# EAGLE schematic HHKB (EAGLE 9.2.0)
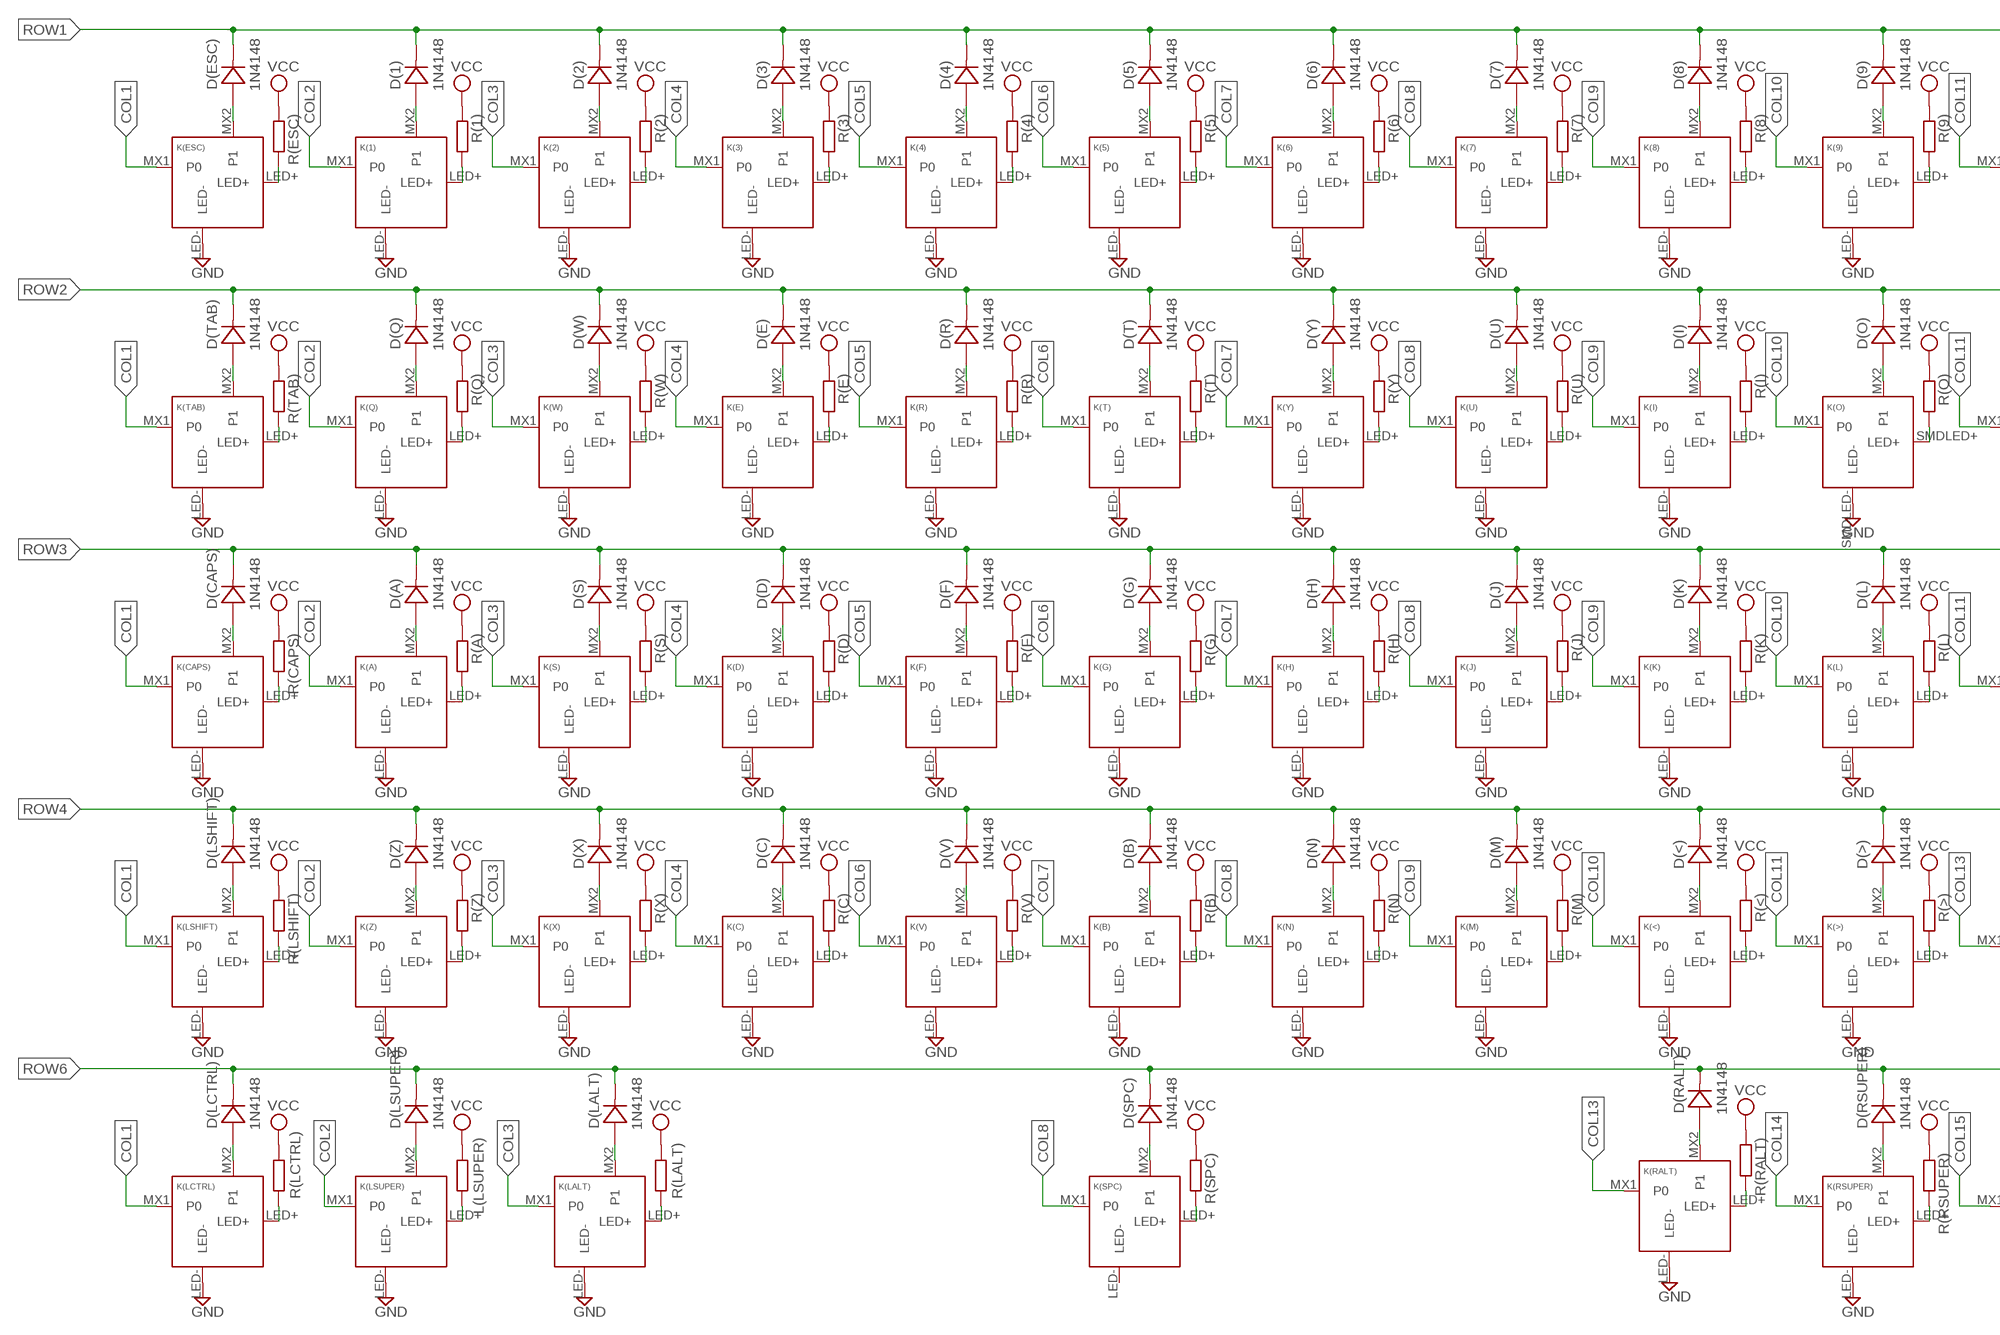
[diagram p0: schematic, sheet 1, part 1 of 2]
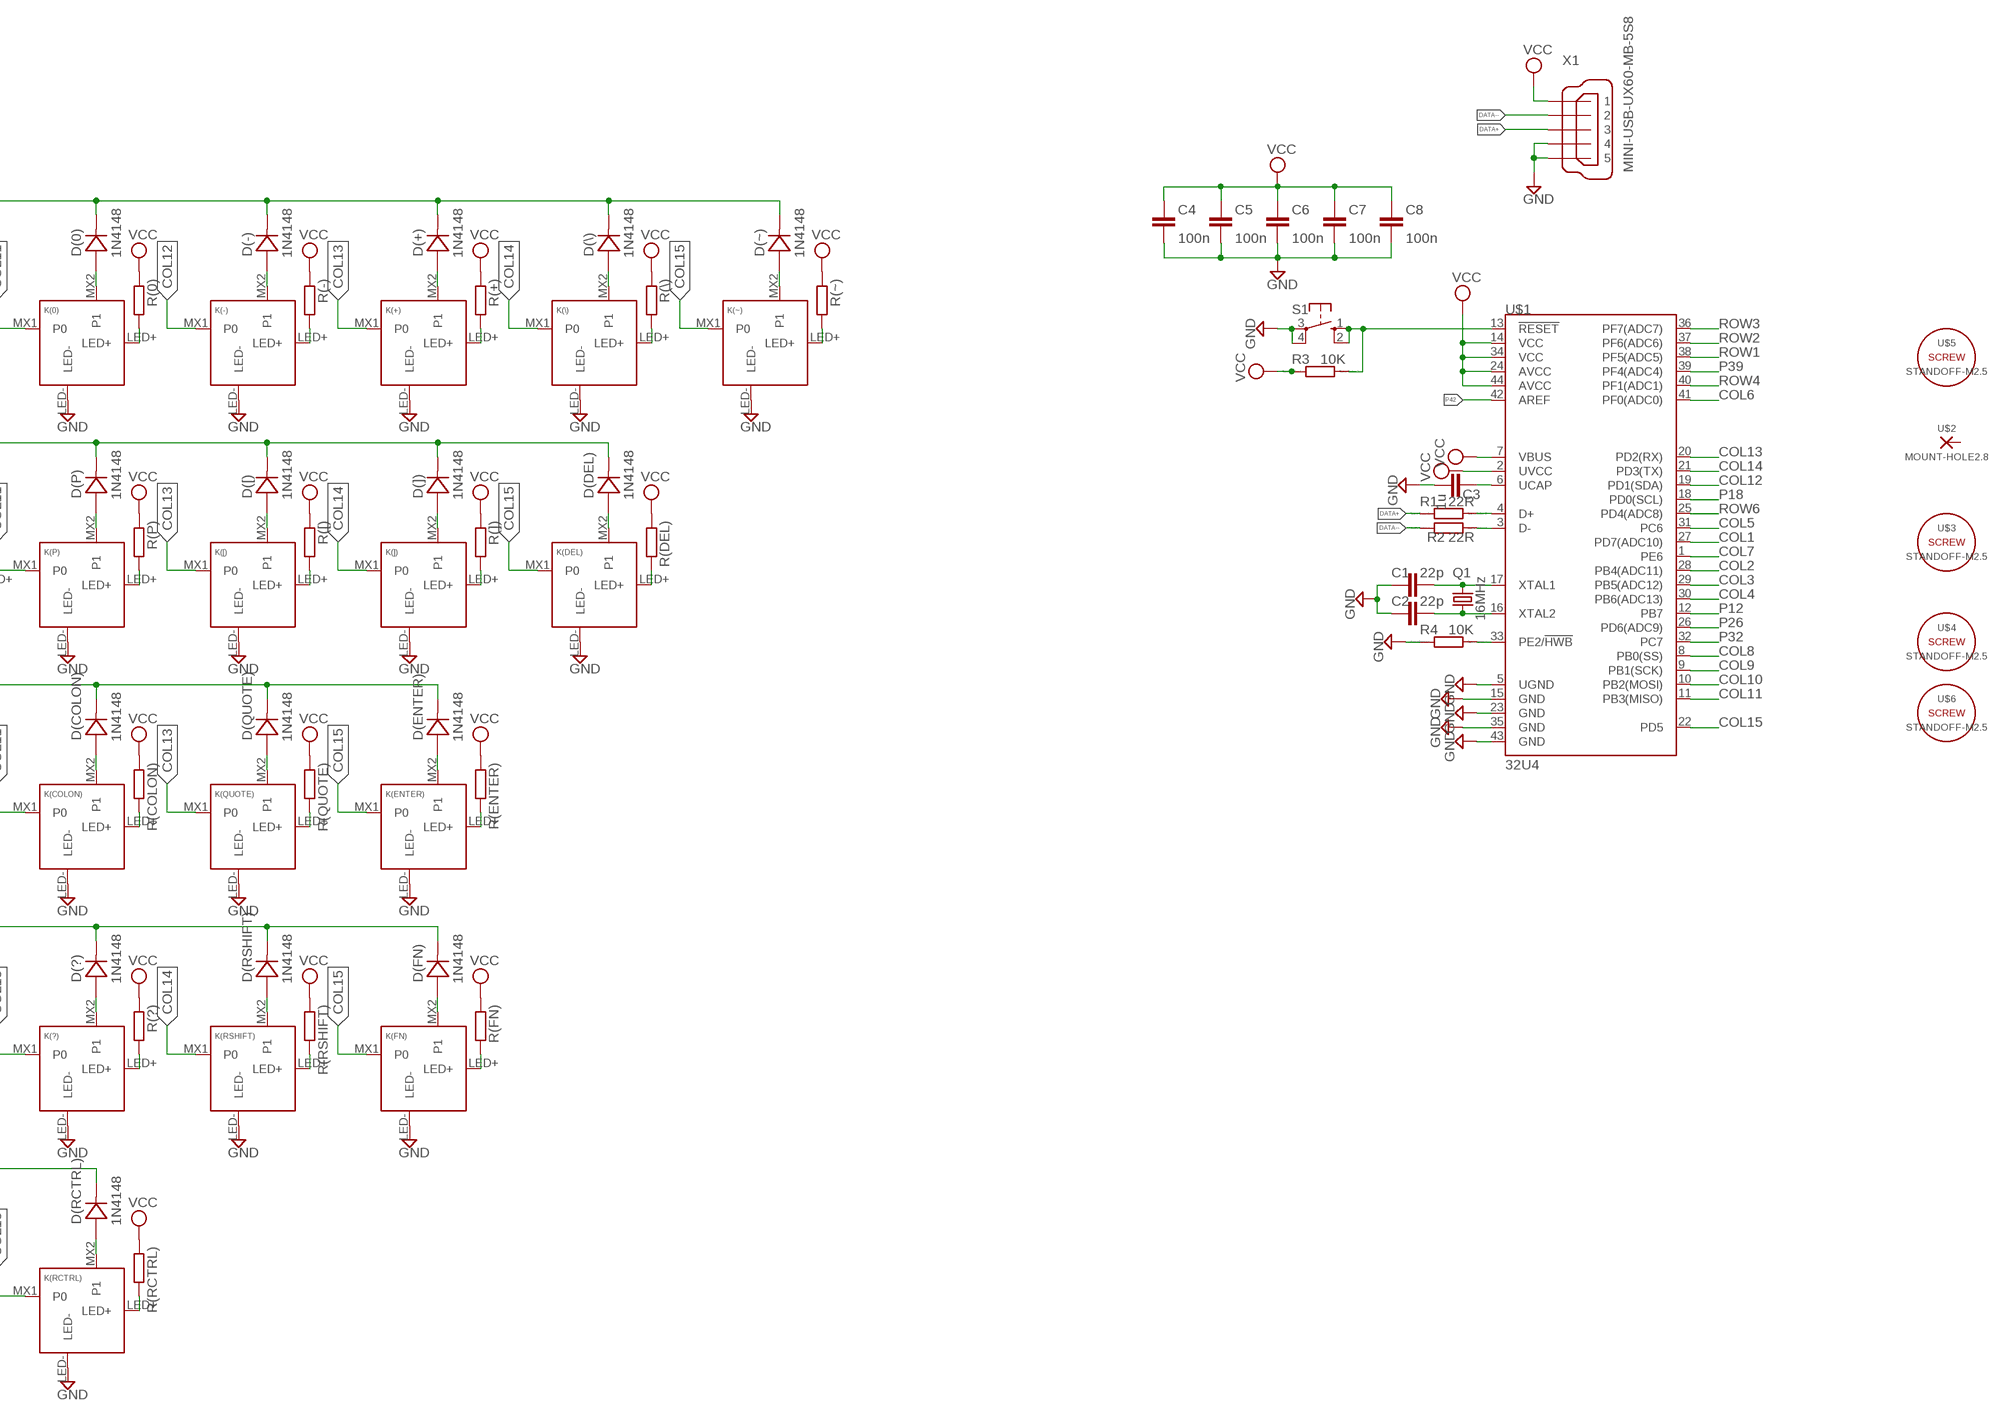
[diagram p1: schematic, sheet 1, part 2 of 2]

## Parts
C1  22p  C-EUC0805K  [C0805K]
C2  22p  C-EUC0805K  [C0805K]
C3  1u  C-EUC0805K  [C0805K]
C4  100n  C-EUC0805K  [C0805K]
C5  100n  C-EUC0805K  [C0805K]
C6  100n  C-EUC0805K  [C0805K]
C7  100n  C-EUC0805K  [C0805K]
C8  100n  C-EUC0805K  [C0805K]
D(0)  1N4148  DIODE-HAND  [DIODE_HAND]
D(1)  1N4148  DIODE-HAND  [DIODE_HAND]
D(2)  1N4148  DIODE-HAND  [DIODE_HAND]
D(3)  1N4148  DIODE-HAND  [DIODE_HAND]
D(4)  1N4148  DIODE-HAND  [DIODE_HAND]
D(5)  1N4148  DIODE-HAND  [DIODE_HAND]
D(6)  1N4148  DIODE-HAND  [DIODE_HAND]
D(7)  1N4148  DIODE-HAND  [DIODE_HAND]
D(8)  1N4148  DIODE-HAND  [DIODE_HAND]
D(9)  1N4148  DIODE-HAND  [DIODE_HAND]
D(+)  1N4148  DIODE-HAND  [DIODE_HAND]
D(-)  1N4148  DIODE-HAND  [DIODE_HAND]
D(<)  1N4148  DIODE-HAND  [DIODE_HAND]
D(>)  1N4148  DIODE-HAND  [DIODE_HAND]
D(?)  1N4148  DIODE-HAND  [DIODE_HAND]
D([)  1N4148  DIODE-HAND  [DIODE_HAND]
D(\\)  1N4148  DIODE-HAND  [DIODE_HAND]
D(])  1N4148  DIODE-HAND  [DIODE_HAND]
D(A)  1N4148  DIODE-HAND  [DIODE_HAND]
D(B)  1N4148  DIODE-HAND  [DIODE_HAND]
D(C)  1N4148  DIODE-HAND  [DIODE_HAND]
D(CAPS)  1N4148  DIODE-HAND  [DIODE_HAND]
D(COLON)  1N4148  DIODE-HAND  [DIODE_HAND]
D(D)  1N4148  DIODE-HAND  [DIODE_HAND]
D(DEL)  1N4148  DIODE-HAND  [DIODE_HAND]
D(E)  1N4148  DIODE-HAND  [DIODE_HAND]
D(ENTER)  1N4148  DIODE-HAND  [DIODE_HAND]
D(ESC)  1N4148  DIODE-HAND  [DIODE_HAND]
D(F)  1N4148  DIODE-HAND  [DIODE_HAND]
D(FN)  1N4148  DIODE-HAND  [DIODE_HAND]
D(G)  1N4148  DIODE-HAND  [DIODE_HAND]
D(H)  1N4148  DIODE-HAND  [DIODE_HAND]
D(I)  1N4148  DIODE-HAND  [DIODE_HAND]
D(J)  1N4148  DIODE-HAND  [DIODE_HAND]
D(K)  1N4148  DIODE-HAND  [DIODE_HAND]
D(L)  1N4148  DIODE-HAND  [DIODE_HAND]
D(LALT)  1N4148  DIODE-HAND  [DIODE_HAND]
D(LCTRL)  1N4148  DIODE-HAND  [DIODE_HAND]
D(LSHIFT)  1N4148  DIODE-HAND  [DIODE_HAND]
D(LSUPER)  1N4148  DIODE-HAND  [DIODE_HAND]
D(M)  1N4148  DIODE-HAND  [DIODE_HAND]
D(N)  1N4148  DIODE-HAND  [DIODE_HAND]
D(O)  1N4148  DIODE-HAND  [DIODE_HAND]
D(P)  1N4148  DIODE-HAND  [DIODE_HAND]
D(Q)  1N4148  DIODE-HAND  [DIODE_HAND]
D(QUOTE)  1N4148  DIODE-HAND  [DIODE_HAND]
D(R)  1N4148  DIODE-HAND  [DIODE_HAND]
D(RALT)  1N4148  DIODE-HAND  [DIODE_HAND]
D(RCTRL)  1N4148  DIODE-HAND  [DIODE_HAND]
D(RSHIFT)  1N4148  DIODE-HAND  [DIODE_HAND]
D(RSUPER)  1N4148  DIODE-HAND  [DIODE_HAND]
D(S)  1N4148  DIODE-HAND  [DIODE_HAND]
D(SPC)  1N4148  DIODE-HAND  [DIODE_HAND]
D(T)  1N4148  DIODE-HAND  [DIODE_HAND]
D(TAB)  1N4148  DIODE-HAND  [DIODE_HAND]
D(U)  1N4148  DIODE-HAND  [DIODE_HAND]
D(V)  1N4148  DIODE-HAND  [DIODE_HAND]
D(W)  1N4148  DIODE-HAND  [DIODE_HAND]
D(X)  1N4148  DIODE-HAND  [DIODE_HAND]
D(Y)  1N4148  DIODE-HAND  [DIODE_HAND]
D(Z)  1N4148  DIODE-HAND  [DIODE_HAND]
D(~)  1N4148  DIODE-HAND  [DIODE_HAND]
K(0)  KEYSWITCH-LEDTHTHOLE-MXHS-1U-LEDTHTHOLE  [MXHS-1U-LEDTHTHOLE]
K(1)  KEYSWITCH-LEDTHTHOLE-MXHS-1U-LEDTHTHOLE  [MXHS-1U-LEDTHTHOLE]
K(2)  KEYSWITCH-LEDTHTHOLE-MXHS-1U-LEDTHTHOLE  [MXHS-1U-LEDTHTHOLE]
K(3)  KEYSWITCH-LEDTHTHOLE-MXHS-1U-LEDTHTHOLE  [MXHS-1U-LEDTHTHOLE]
K(4)  KEYSWITCH-LEDTHTHOLE-MXHS-1U-LEDTHTHOLE  [MXHS-1U-LEDTHTHOLE]
K(5)  KEYSWITCH-LEDTHTHOLE-MXHS-1U-LEDTHTHOLE  [MXHS-1U-LEDTHTHOLE]
K(6)  KEYSWITCH-LEDTHTHOLE-MXHS-1U-LEDTHTHOLE  [MXHS-1U-LEDTHTHOLE]
K(7)  KEYSWITCH-LEDTHTHOLE-MXHS-1U-LEDTHTHOLE  [MXHS-1U-LEDTHTHOLE]
K(8)  KEYSWITCH-LEDTHTHOLE-MXHS-1U-LEDTHTHOLE  [MXHS-1U-LEDTHTHOLE]
K(9)  KEYSWITCH-LEDTHTHOLE-MXHS-1U-LEDTHTHOLE  [MXHS-1U-LEDTHTHOLE]
K(+)  KEYSWITCH-LEDTHTHOLE-MXHS-1U-LEDTHTHOLE  [MXHS-1U-LEDTHTHOLE]
K(-)  KEYSWITCH-LEDTHTHOLE-MXHS-1U-LEDTHTHOLE  [MXHS-1U-LEDTHTHOLE]
K(<)  KEYSWITCH-LEDTHTHOLE-MXHS-1U-LEDTHTHOLE  [MXHS-1U-LEDTHTHOLE]
K(>)  KEYSWITCH-LEDTHTHOLE-MXHS-1U-LEDTHTHOLE  [MXHS-1U-LEDTHTHOLE]
K(?)  KEYSWITCH-LEDTHTHOLE-MXHS-1U-LEDTHTHOLE  [MXHS-1U-LEDTHTHOLE]
K([)  KEYSWITCH-LEDTHTHOLE-MXHS-1U-LEDTHTHOLE  [MXHS-1U-LEDTHTHOLE]
K(\\)  KEYSWITCH-LEDTHTHOLE-MXHS-1U-LEDTHTHOLE  [MXHS-1U-LEDTHTHOLE]
K(])  KEYSWITCH-LEDTHTHOLE-MXHS-1U-LEDTHTHOLE  [MXHS-1U-LEDTHTHOLE]
K(A)  KEYSWITCH-LEDTHTHOLE-MXHS-1U-LEDTHTHOLE  [MXHS-1U-LEDTHTHOLE]
K(B)  KEYSWITCH-LEDTHTHOLE-MXHS-1U-LEDTHTHOLE  [MXHS-1U-LEDTHTHOLE]
K(C)  KEYSWITCH-LEDTHTHOLE-MXHS-1U-LEDTHTHOLE  [MXHS-1U-LEDTHTHOLE]
K(CAPS)  KEYSWITCH-LEDTHTHOLE-MXHS-1U-LEDTHTHOLE  [MXHS-1U-LEDTHTHOLE]
K(COLON)  KEYSWITCH-LEDTHTHOLE-MXHS-1U-LEDTHTHOLE  [MXHS-1U-LEDTHTHOLE]
K(D)  KEYSWITCH-LEDTHTHOLE-MXHS-1U-LEDTHTHOLE  [MXHS-1U-LEDTHTHOLE]
K(DEL)  KEYSWITCH-LEDTHTHOLE-MXHS-1U-LEDTHTHOLE  [MXHS-1U-LEDTHTHOLE]
K(E)  KEYSWITCH-LEDTHTHOLE-MXHS-1U-LEDTHTHOLE  [MXHS-1U-LEDTHTHOLE]
K(ENTER)  KEYSWITCH-LEDTHTHOLE-MXHS-2U-LEDTHTHOLE  [MXHS-2U-LEDTHTHOLE]
K(ESC)  KEYSWITCH-LEDTHTHOLE-MXHS-1U-LEDTHTHOLE  [MXHS-1U-LEDTHTHOLE]
K(F)  KEYSWITCH-LEDTHTHOLE-MXHS-1U-LEDTHTHOLE  [MXHS-1U-LEDTHTHOLE]
K(FN)  KEYSWITCH-LEDTHTHOLE-MXHS-1U-LEDTHTHOLE  [MXHS-1U-LEDTHTHOLE]
K(G)  KEYSWITCH-LEDTHTHOLE-MXHS-1U-LEDTHTHOLE  [MXHS-1U-LEDTHTHOLE]
K(H)  KEYSWITCH-LEDTHTHOLE-MXHS-1U-LEDTHTHOLE  [MXHS-1U-LEDTHTHOLE]
K(I)  KEYSWITCH-LEDTHTHOLE-MXHS-1U-LEDTHTHOLE  [MXHS-1U-LEDTHTHOLE]
K(J)  KEYSWITCH-LEDTHTHOLE-MXHS-1U-LEDTHTHOLE  [MXHS-1U-LEDTHTHOLE]
K(K)  KEYSWITCH-LEDTHTHOLE-MXHS-1U-LEDTHTHOLE  [MXHS-1U-LEDTHTHOLE]
K(L)  KEYSWITCH-LEDTHTHOLE-MXHS-1U-LEDTHTHOLE  [MXHS-1U-LEDTHTHOLE]
K(LALT)  KEYSWITCH-LEDTHTHOLE-MXHS-1U-LEDTHTHOLE  [MXHS-1U-LEDTHTHOLE]
K(LCTRL)  KEYSWITCH-LEDTHTHOLE-MXHS-1U-LEDTHTHOLE  [MXHS-1U-LEDTHTHOLE]
K(LSHIFT)  KEYSWITCH-LEDTHTHOLE-MXHS-2U-LEDTHTHOLE  [MXHS-2U-LEDTHTHOLE]
K(LSUPER)  KEYSWITCH-LEDTHTHOLE-MXHS-1U-LEDTHTHOLE  [MXHS-1U-LEDTHTHOLE]
K(M)  KEYSWITCH-LEDTHTHOLE-MXHS-1U-LEDTHTHOLE  [MXHS-1U-LEDTHTHOLE]
K(N)  KEYSWITCH-LEDTHTHOLE-MXHS-1U-LEDTHTHOLE  [MXHS-1U-LEDTHTHOLE]
K(O)  KEYSWITCH-SMDLED-MXHSPCB-1U-SMDLED  [MXHSPCB-1U-SMDLED]
K(P)  KEYSWITCH-LEDTHTHOLE-MXHS-1U-LEDTHTHOLE  [MXHS-1U-LEDTHTHOLE]
K(Q)  KEYSWITCH-LEDTHTHOLE-MXHS-1U-LEDTHTHOLE  [MXHS-1U-LEDTHTHOLE]
K(QUOTE)  KEYSWITCH-LEDTHTHOLE-MXHS-1U-LEDTHTHOLE  [MXHS-1U-LEDTHTHOLE]
K(R)  KEYSWITCH-LEDTHTHOLE-MXHS-1U-LEDTHTHOLE  [MXHS-1U-LEDTHTHOLE]
K(RALT)  KEYSWITCH-LEDTHTHOLE-MXHS-1U-LEDTHTHOLE  [MXHS-1U-LEDTHTHOLE]
K(RCTRL)  KEYSWITCH-LEDTHTHOLE-MXHS-1U-LEDTHTHOLE  [MXHS-1U-LEDTHTHOLE]
K(RSHIFT)  KEYSWITCH-LEDTHTHOLE-MXHS-1U-LEDTHTHOLE  [MXHS-1U-LEDTHTHOLE]
K(RSUPER)  KEYSWITCH-LEDTHTHOLE-MXHS-1U-LEDTHTHOLE  [MXHS-1U-LEDTHTHOLE]
K(S)  KEYSWITCH-LEDTHTHOLE-MXHS-1U-LEDTHTHOLE  [MXHS-1U-LEDTHTHOLE]
K(SPC)  KEYSWITCH-LEDTHTHOLE-MXHS-7U-LEDTHTHOLE  [MXHS-7U-LEDTHTHOLE]
K(T)  KEYSWITCH-LEDTHTHOLE-MXHS-1U-LEDTHTHOLE  [MXHS-1U-LEDTHTHOLE]
K(TAB)  KEYSWITCH-LEDTHTHOLE-MXHS-1U-LEDTHTHOLE  [MXHS-1U-LEDTHTHOLE]
K(U)  KEYSWITCH-LEDTHTHOLE-MXHS-1U-LEDTHTHOLE  [MXHS-1U-LEDTHTHOLE]
K(V)  KEYSWITCH-LEDTHTHOLE-MXHS-1U-LEDTHTHOLE  [MXHS-1U-LEDTHTHOLE]
K(W)  KEYSWITCH-LEDTHTHOLE-MXHS-1U-LEDTHTHOLE  [MXHS-1U-LEDTHTHOLE]
K(X)  KEYSWITCH-LEDTHTHOLE-MXHS-1U-LEDTHTHOLE  [MXHS-1U-LEDTHTHOLE]
K(Y)  KEYSWITCH-LEDTHTHOLE-MXHS-1U-LEDTHTHOLE  [MXHS-1U-LEDTHTHOLE]
K(Z)  KEYSWITCH-LEDTHTHOLE-MXHS-1U-LEDTHTHOLE  [MXHS-1U-LEDTHTHOLE]
K(~)  KEYSWITCH-LEDTHTHOLE-MXHS-1U-LEDTHTHOLE  [MXHS-1U-LEDTHTHOLE]
L(LSUPER)  RESISTOR-THT-SMALL  [THT-RESISTOR-SMALL]
Q1  16MHz  KX-9B  [5.0X3.2_2]
R1  22R  RR1206  [R1206]
R2  22R  RR1206  [R1206]
R3  10K  RR1206  [R1206]
R4  10K  RR1206  [R1206]
R(0)  RESISTOR-THT-SMALL  [THT-RESISTOR-SMALL]
R(1)  RESISTOR-THT-SMALL  [THT-RESISTOR-SMALL]
R(2)  RESISTOR-THT-SMALL  [THT-RESISTOR-SMALL]
R(3)  RESISTOR-THT-SMALL  [THT-RESISTOR-SMALL]
R(4)  RESISTOR-THT-SMALL  [THT-RESISTOR-SMALL]
R(5)  RESISTOR-THT-SMALL  [THT-RESISTOR-SMALL]
R(6)  RESISTOR-THT-SMALL  [THT-RESISTOR-SMALL]
R(7)  RESISTOR-THT-SMALL  [THT-RESISTOR-SMALL]
R(8)  RESISTOR-THT-SMALL  [THT-RESISTOR-SMALL]
R(9)  RESISTOR-THT-SMALL  [THT-RESISTOR-SMALL]
R(+)  RESISTOR-THT-SMALL  [THT-RESISTOR-SMALL]
R(-)  RESISTOR-THT-SMALL  [THT-RESISTOR-SMALL]
R(<)  RESISTOR-THT-SMALL  [THT-RESISTOR-SMALL]
R(>)  RESISTOR-THT-SMALL  [THT-RESISTOR-SMALL]
R(?)  RESISTOR-THT-SMALL  [THT-RESISTOR-SMALL]
R([)  RESISTOR-THT-SMALL  [THT-RESISTOR-SMALL]
R(\\)  RESISTOR-THT-SMALL  [THT-RESISTOR-SMALL]
R(])  RESISTOR-THT-SMALL  [THT-RESISTOR-SMALL]
R(A)  RESISTOR-THT-SMALL  [THT-RESISTOR-SMALL]
R(B)  RESISTOR-THT-SMALL  [THT-RESISTOR-SMALL]
R(C)  RESISTOR-THT-SMALL  [THT-RESISTOR-SMALL]
R(CAPS)  RESISTOR-THT-SMALL  [THT-RESISTOR-SMALL]
R(COLON)  RESISTOR-THT-SMALL  [THT-RESISTOR-SMALL]
R(D)  RESISTOR-THT-SMALL  [THT-RESISTOR-SMALL]
R(DEL)  RESISTOR-THT-SMALL  [THT-RESISTOR-SMALL]
R(E)  RESISTOR-THT-SMALL  [THT-RESISTOR-SMALL]
R(ENTER)  RESISTOR-THT-SMALL  [THT-RESISTOR-SMALL]
R(ESC)  RESISTOR-THT-SMALL  [THT-RESISTOR-SMALL]
R(F)  RESISTOR-THT-SMALL  [THT-RESISTOR-SMALL]
R(FN)  RESISTOR-THT-SMALL  [THT-RESISTOR-SMALL]
R(G)  RESISTOR-THT-SMALL  [THT-RESISTOR-SMALL]
R(H)  RESISTOR-THT-SMALL  [THT-RESISTOR-SMALL]
R(I)  RESISTOR-THT-SMALL  [THT-RESISTOR-SMALL]
R(J)  RESISTOR-THT-SMALL  [THT-RESISTOR-SMALL]
R(K)  RESISTOR-THT-SMALL  [THT-RESISTOR-SMALL]
R(L)  RESISTOR-THT-SMALL  [THT-RESISTOR-SMALL]
R(LALT)  RESISTOR-THT-SMALL  [THT-RESISTOR-SMALL]
R(LCTRL)  RESISTOR-THT-SMALL  [THT-RESISTOR-SMALL]
R(LSHIFT)  RESISTOR-THT-SMALL  [THT-RESISTOR-SMALL]
R(M)  RESISTOR-THT-SMALL  [THT-RESISTOR-SMALL]
R(N)  RESISTOR-THT-SMALL  [THT-RESISTOR-SMALL]
R(O)  RESISTOR-THT-SMALL  [THT-RESISTOR-SMALL]
R(P)  RESISTOR-THT-SMALL  [THT-RESISTOR-SMALL]
R(Q)  RESISTOR-THT-SMALL  [THT-RESISTOR-SMALL]
R(QUOTE)  RESISTOR-THT-SMALL  [THT-RESISTOR-SMALL]
R(R)  RESISTOR-THT-SMALL  [THT-RESISTOR-SMALL]
R(RALT)  RESISTOR-THT-SMALL  [THT-RESISTOR-SMALL]
R(RCTRL)  RESISTOR-THT-SMALL  [THT-RESISTOR-SMALL]
R(RSHIFT)  RESISTOR-THT-SMALL  [THT-RESISTOR-SMALL]
R(RSUPER)  RESISTOR-THT-SMALL  [THT-RESISTOR-SMALL]
R(S)  RESISTOR-THT-SMALL  [THT-RESISTOR-SMALL]
R(SPC)  RESISTOR-THT-SMALL  [THT-RESISTOR-SMALL]
R(T)  RESISTOR-THT-SMALL  [THT-RESISTOR-SMALL]
R(TAB)  RESISTOR-THT-SMALL  [THT-RESISTOR-SMALL]
R(U)  RESISTOR-THT-SMALL  [THT-RESISTOR-SMALL]
R(V)  RESISTOR-THT-SMALL  [THT-RESISTOR-SMALL]
R(W)  RESISTOR-THT-SMALL  [THT-RESISTOR-SMALL]
R(X)  RESISTOR-THT-SMALL  [THT-RESISTOR-SMALL]
R(Y)  RESISTOR-THT-SMALL  [THT-RESISTOR-SMALL]
R(Z)  RESISTOR-THT-SMALL  [THT-RESISTOR-SMALL]
R(~)  RESISTOR-THT-SMALL  [THT-RESISTOR-SMALL]
S1  10-XX  [B3F-10XX]
U$1  32U4  ATMEGA32U4TQFP-44  [TQFP44]
U$2  MOUNT-HOLE2.8  2,54/1,0  [2,54/1,0]
U$3  STANDOFF-M2.5  [STANDOFF-M2.5]
U$4  STANDOFF-M2.5  [STANDOFF-M2.5]
U$5  STANDOFF-M2.5  [STANDOFF-M2.5]
U$6  STANDOFF-M2.5  [STANDOFF-M2.5]
X1  MINI-USB-UX60-MB-5S8  [UX60-MB-5S8]

## Nets
COL1: K(CAPS).MX1(P0) K(ESC).MX1(P0) K(LCTRL).MX1(P0) K(LSHIFT).MX1(P0) K(TAB).MX1(P0) U$1.27(PD7(ADC10))
COL2: K(1).MX1(P0) K(A).MX1(P0) K(LSUPER).MX1(P0) K(Q).MX1(P0) K(Z).MX1(P0) U$1.28(PB4(ADC11))
COL3: K(2).MX1(P0) K(LALT).MX1(P0) K(S).MX1(P0) K(W).MX1(P0) K(X).MX1(P0) U$1.29(PB5(ADC12))
COL4: K(3).MX1(P0) K(C).MX1(P0) K(D).MX1(P0) K(E).MX1(P0) U$1.30(PB6(ADC13))
COL5: K(4).MX1(P0) K(F).MX1(P0) K(R).MX1(P0) U$1.31(PC6)
COL6: K(5).MX1(P0) K(G).MX1(P0) K(T).MX1(P0) K(V).MX1(P0) U$1.41(PF0(ADC0))
COL7: K(6).MX1(P0) K(B).MX1(P0) K(H).MX1(P0) K(Y).MX1(P0) U$1.1(PE6)
COL8: K(7).MX1(P0) K(J).MX1(P0) K(N).MX1(P0) K(SPC).MX1(P0) K(U).MX1(P0) U$1.8(PB0(SS))
COL9: K(8).MX1(P0) K(I).MX1(P0) K(K).MX1(P0) K(M).MX1(P0) U$1.9(PB1(SCK))
COL10: K(9).MX1(P0) K(<).MX1(P0) K(L).MX1(P0) K(O).MX1(P0) U$1.10(PB2(MOSI))
COL11: K(0).MX1(P0) K(>).MX1(P0) K(COLON).MX1(P0) K(P).MX1(P0) U$1.11(PB3(MISO))
COL12: K(-).MX1(P0) U$1.19(PD1(SDA))
COL13: K(+).MX1(P0) K(?).MX1(P0) K([).MX1(P0) K(QUOTE).MX1(P0) K(RALT).MX1(P0) U$1.20(PD2(RX))
COL14: K(\\).MX1(P0) K(]).MX1(P0) K(RSHIFT).MX1(P0) K(RSUPER).MX1(P0) U$1.21(PD3(TX))
COL15: K(DEL).MX1(P0) K(ENTER).MX1(P0) K(FN).MX1(P0) K(RCTRL).MX1(P0) K(~).MX1(P0) U$1.22(PD5)
DATA+: R1.1 X1.3
DATA--: R2.1 X1.2
GND: C1.2 C2.2 C3.2 C4.2 C5.2 C6.2 C7.2 C8.2 K(0).LED- K(1).LED- K(2).LED- K(3).LED- K(4).LED- K(5).LED- K(6).LED- K(7).LED- K(8).LED- K(9).LED- K(+).LED- K(-).LED- K(<).LED- K(>).LED- K(?).LED- K([).LED- K(\\).LED- K(]).LED- K(A).LED- K(B).LED- K(C).LED- K(CAPS).LED- K(COLON).LED- K(D).LED- K(DEL).LED- K(E).LED- K(ENTER).LED- K(ESC).LED- K(F).LED- K(FN).LED- K(G).LED- K(H).LED- K(I).LED- K(J).LED- K(K).LED- K(L).LED- K(LALT).LED- K(LCTRL).LED- K(LSHIFT).LED- K(LSUPER).LED- K(M).LED- K(N).LED- K(O).SMDLED-(LED-) K(P).LED- K(Q).LED- K(QUOTE).LED- K(R).LED- K(RALT).LED- K(RCTRL).LED- K(RSHIFT).LED- K(RSUPER).LED- K(S).LED- K(T).LED- K(TAB).LED- K(U).LED- K(V).LED- K(W).LED- K(X).LED- K(Y).LED- K(Z).LED- K(~).LED- R4.1 S1.3(P) S1.4(P1) U$1.5(UGND) U$1.15(GND) U$1.23(GND) U$1.35(GND) U$1.43(GND) X1.4 X1.5
N$1: D(8).A1(A) D(8).A2(A) D(8).A3(A) K(8).MX2(P1)
N$2: D(ESC).A1(A) D(ESC).A2(A) D(ESC).A3(A) K(ESC).MX2(P1)
N$3: D(\\).A1(A) D(\\).A2(A) D(\\).A3(A) K(\\).MX2(P1)
N$4: D(~).A1(A) D(~).A2(A) D(~).A3(A) K(~).MX2(P1)
N$5: D(+).A1(A) D(+).A2(A) D(+).A3(A) K(+).MX2(P1)
N$6: D(-).A1(A) D(-).A2(A) D(-).A3(A) K(-).MX2(P1)
N$7: D(0).A1(A) D(0).A2(A) D(0).A3(A) K(0).MX2(P1)
N$8: D(7).A1(A) D(7).A2(A) D(7).A3(A) K(7).MX2(P1)
N$9: D(6).A1(A) D(6).A2(A) D(6).A3(A) K(6).MX2(P1)
N$10: D(5).A1(A) D(5).A2(A) D(5).A3(A) K(5).MX2(P1)
N$11: D(4).A1(A) D(4).A2(A) D(4).A3(A) K(4).MX2(P1)
N$12: D(3).A1(A) D(3).A2(A) D(3).A3(A) K(3).MX2(P1)
N$13: D(2).A1(A) D(2).A2(A) D(2).A3(A) K(2).MX2(P1)
N$14: D(1).A1(A) D(1).A2(A) D(1).A3(A) K(1).MX2(P1)
N$15: K(P).LED+ R(P).B1 R(P).B2 R(P).B3
N$16: D(9).A1(A) D(9).A2(A) D(9).A3(A) K(9).MX2(P1)
N$17: K(ESC).LED+ R(ESC).B1 R(ESC).B2 R(ESC).B3
N$18: K(~).LED+ R(~).B1 R(~).B2 R(~).B3
N$19: K(\\).LED+ R(\\).B1 R(\\).B2 R(\\).B3
N$20: K(+).LED+ R(+).B1 R(+).B2 R(+).B3
N$21: K(-).LED+ R(-).B1 R(-).B2 R(-).B3
N$22: K(0).LED+ R(0).B1 R(0).B2 R(0).B3
N$23: K(9).LED+ R(9).B1 R(9).B2 R(9).B3
N$24: K(8).LED+ R(8).B1 R(8).B2 R(8).B3
N$25: K(4).LED+ R(4).B1 R(4).B2 R(4).B3
N$26: K(5).LED+ R(5).B1 R(5).B2 R(5).B3
N$27: K(6).LED+ R(6).B1 R(6).B2 R(6).B3
N$28: K(7).LED+ R(7).B1 R(7).B2 R(7).B3
N$29: K(3).LED+ R(3).B1 R(3).B2 R(3).B3
N$30: K(1).LED+ R(1).B1 R(1).B2 R(1).B3
N$31: K(2).LED+ R(2).B1 R(2).B2 R(2).B3
N$32: K(DEL).LED+ R(DEL).B1 R(DEL).B2 R(DEL).B3
N$33: K(]).LED+ R(]).B1 R(]).B2 R(]).B3
N$34: K([).LED+ R([).B1 R([).B2 R([).B3
N$35: K(O).SMDLED+(LED+) R(O).B1 R(O).B2 R(O).B3
N$36: K(I).LED+ R(I).B1 R(I).B2 R(I).B3
N$37: K(TAB).LED+ R(TAB).B1 R(TAB).B2 R(TAB).B3
N$38: K(Q).LED+ R(Q).B1 R(Q).B2 R(Q).B3
N$39: K(W).LED+ R(W).B1 R(W).B2 R(W).B3
N$40: K(E).LED+ R(E).B1 R(E).B2 R(E).B3
N$41: K(T).LED+ R(T).B1 R(T).B2 R(T).B3
N$42: K(R).LED+ R(R).B1 R(R).B2 R(R).B3
N$43: K(Y).LED+ R(Y).B1 R(Y).B2 R(Y).B3
N$44: K(U).LED+ R(U).B1 R(U).B2 R(U).B3
N$45: K(A).LED+ R(A).B1 R(A).B2 R(A).B3
N$46: K(S).LED+ R(S).B1 R(S).B2 R(S).B3
N$47: K(CAPS).LED+ R(CAPS).B1 R(CAPS).B2 R(CAPS).B3
N$48: K(D).LED+ R(D).B1 R(D).B2 R(D).B3
N$49: K(G).LED+ R(G).B1 R(G).B2 R(G).B3
N$50: K(F).LED+ R(F).B1 R(F).B2 R(F).B3
N$51: K(J).LED+ R(J).B1 R(J).B2 R(J).B3
N$52: K(H).LED+ R(H).B1 R(H).B2 R(H).B3
N$53: K(K).LED+ R(K).B1 R(K).B2 R(K).B3
N$54: K(L).LED+ R(L).B1 R(L).B2 R(L).B3
N$55: K(COLON).LED+ R(COLON).B1 R(COLON).B2 R(COLON).B3
N$56: K(QUOTE).LED+ R(QUOTE).B1 R(QUOTE).B2 R(QUOTE).B3
N$57: K(ENTER).LED+ R(ENTER).B1 R(ENTER).B2 R(ENTER).B3
N$58: K(LSHIFT).LED+ R(LSHIFT).B1 R(LSHIFT).B2 R(LSHIFT).B3
N$59: K(Z).LED+ R(Z).B1 R(Z).B2 R(Z).B3
N$60: K(X).LED+ R(X).B1 R(X).B2 R(X).B3
N$61: K(C).LED+ R(C).B1 R(C).B2 R(C).B3
N$62: K(V).LED+ R(V).B1 R(V).B2 R(V).B3
N$63: K(B).LED+ R(B).B1 R(B).B2 R(B).B3
N$64: K(N).LED+ R(N).B1 R(N).B2 R(N).B3
N$65: K(M).LED+ R(M).B1 R(M).B2 R(M).B3
N$66: K(<).LED+ R(<).B1 R(<).B2 R(<).B3
N$67: K(>).LED+ R(>).B1 R(>).B2 R(>).B3
N$68: K(?).LED+ R(?).B1 R(?).B2 R(?).B3
N$69: K(RSHIFT).LED+ R(RSHIFT).B1 R(RSHIFT).B2 R(RSHIFT).B3
N$70: K(FN).LED+ R(FN).B1 R(FN).B2 R(FN).B3
N$71: K(LSUPER).LED+ L(LSUPER).A1 L(LSUPER).A2 L(LSUPER).A3
N$72: K(LCTRL).LED+ R(LCTRL).A1 R(LCTRL).A2 R(LCTRL).A3
N$73: K(SPC).LED+ R(SPC).B1 R(SPC).B2 R(SPC).B3
N$74: D(TAB).A1(A) D(TAB).A2(A) D(TAB).A3(A) K(TAB).MX2(P1)
N$75: D(DEL).A1(A) D(DEL).A2(A) D(DEL).A3(A) K(DEL).MX2(P1)
N$76: K(RSUPER).LED+ R(RSUPER).B1 R(RSUPER).B2 R(RSUPER).B3
N$77: D(]).A1(A) D(]).A2(A) D(]).A3(A) K(]).MX2(P1)
N$78: D([).A1(A) D([).A2(A) D([).A3(A) K([).MX2(P1)
N$79: D(P).A1(A) D(P).A2(A) D(P).A3(A) K(P).MX2(P1)
N$80: D(U).A1(A) D(U).A2(A) D(U).A3(A) K(U).MX2(P1)
N$81: D(Y).A1(A) D(Y).A2(A) D(Y).A3(A) K(Y).MX2(P1)
N$82: D(T).A1(A) D(T).A2(A) D(T).A3(A) K(T).MX2(P1)
N$83: D(R).A1(A) D(R).A2(A) D(R).A3(A) K(R).MX2(P1)
N$84: D(E).A1(A) D(E).A2(A) D(E).A3(A) K(E).MX2(P1)
N$85: D(W).A1(A) D(W).A2(A) D(W).A3(A) K(W).MX2(P1)
N$86: D(Q).A1(A) D(Q).A2(A) D(Q).A3(A) K(Q).MX2(P1)
N$87: D(I).A1(A) D(I).A2(A) D(I).A3(A) K(I).MX2(P1)
N$88: D(O).A1(A) D(O).A2(A) D(O).A3(A) K(O).MX2(P1)
N$89: K(RCTRL).LED+ R(RCTRL).B1 R(RCTRL).B2 R(RCTRL).B3
N$90: D(RALT).A1(A) D(RALT).A2(A) D(RALT).A3(A) K(RALT).MX2(P1)
N$91: K(RALT).LED+ R(RALT).B1 R(RALT).B2 R(RALT).B3
N$92: D(LALT).A1(A) D(LALT).A2(A) D(LALT).A3(A) K(LALT).MX2(P1)
N$93: K(LALT).LED+ R(LALT).A1 R(LALT).A2 R(LALT).A3
N$94: C1.1 Q1.2 U$1.17(XTAL1)
N$95: C2.1 Q1.1 U$1.16(XTAL2)
N$97: C3.1 U$1.6(UCAP)
N$98: R3.2 S1.1(S) S1.2(S1) U$1.13(!RESET)
N$99: R1.2 U$1.4(D+)
N$100: R2.2 U$1.3(D-)
N$101: R4.2 U$1.33(PE2/!HWB)
N$114: D(CAPS).A1(A) D(CAPS).A2(A) D(CAPS).A3(A) K(CAPS).MX2(P1)
N$116: D(ENTER).A1(A) D(ENTER).A2(A) D(ENTER).A3(A) K(ENTER).MX2(P1)
N$117: D(QUOTE).A1(A) D(QUOTE).A2(A) D(QUOTE).A3(A) K(QUOTE).MX2(P1)
N$118: D(COLON).A1(A) D(COLON).A2(A) D(COLON).A3(A) K(COLON).MX2(P1)
N$119: D(J).A1(A) D(J).A2(A) D(J).A3(A) K(J).MX2(P1)
N$120: D(H).A1(A) D(H).A2(A) D(H).A3(A) K(H).MX2(P1)
N$121: D(G).A1(A) D(G).A2(A) D(G).A3(A) K(G).MX2(P1)
N$122: D(F).A1(A) D(F).A2(A) D(F).A3(A) K(F).MX2(P1)
N$123: D(D).A1(A) D(D).A2(A) D(D).A3(A) K(D).MX2(P1)
N$124: D(S).A1(A) D(S).A2(A) D(S).A3(A) K(S).MX2(P1)
N$125: D(A).A1(A) D(A).A2(A) D(A).A3(A) K(A).MX2(P1)
N$126: D(K).A1(A) D(K).A2(A) D(K).A3(A) K(K).MX2(P1)
N$127: D(L).A1(A) D(L).A2(A) D(L).A3(A) K(L).MX2(P1)
N$151: D(LSHIFT).A1(A) D(LSHIFT).A2(A) D(LSHIFT).A3(A) K(LSHIFT).MX2(P1)
N$152: D(FN).A1(A) D(FN).A2(A) D(FN).A3(A) K(FN).MX2(P1)
N$153: D(RSHIFT).A1(A) D(RSHIFT).A2(A) D(RSHIFT).A3(A) K(RSHIFT).MX2(P1)
N$154: D(?).A1(A) D(?).A2(A) D(?).A3(A) K(?).MX2(P1)
N$155: D(M).A1(A) D(M).A2(A) D(M).A3(A) K(M).MX2(P1)
N$156: D(N).A1(A) D(N).A2(A) D(N).A3(A) K(N).MX2(P1)
N$157: D(B).A1(A) D(B).A2(A) D(B).A3(A) K(B).MX2(P1)
N$158: D(V).A1(A) D(V).A2(A) D(V).A3(A) K(V).MX2(P1)
N$159: D(C).A1(A) D(C).A2(A) D(C).A3(A) K(C).MX2(P1)
N$160: D(X).A1(A) D(X).A2(A) D(X).A3(A) K(X).MX2(P1)
N$161: D(Z).A1(A) D(Z).A2(A) D(Z).A3(A) K(Z).MX2(P1)
N$162: D(<).A1(A) D(<).A2(A) D(<).A3(A) K(<).MX2(P1)
N$163: D(>).A1(A) D(>).A2(A) D(>).A3(A) K(>).MX2(P1)
N$190: D(LCTRL).A1(A) D(LCTRL).A2(A) D(LCTRL).A3(A) K(LCTRL).MX2(P1)
N$193: D(RCTRL).A1(A) D(RCTRL).A2(A) D(RCTRL).A3(A) K(RCTRL).MX2(P1)
N$196: D(SPC).A1(A) D(SPC).A2(A) D(SPC).A3(A) K(SPC).MX2(P1)
N$200: D(LSUPER).A1(A) D(LSUPER).A2(A) D(LSUPER).A3(A) K(LSUPER).MX2(P1)
N$202: D(RSUPER).A1(A) D(RSUPER).A2(A) D(RSUPER).A3(A) K(RSUPER).MX2(P1)
P12: U$1.12(PB7)
P18: U$1.18(PD0(SCL))
P26: U$1.26(PD6(ADC9))
P32: U$1.32(PC7)
P39: U$1.39(PF4(ADC4))
P42: U$1.42(AREF)
ROW1: D(0).C1(C) D(0).C2(C) D(0).C3(C) D(1).C1(C) D(1).C2(C) D(1).C3(C) D(2).C1(C) D(2).C2(C) D(2).C3(C) D(3).C1(C) D(3).C2(C) D(3).C3(C) D(4).C1(C) D(4).C2(C) D(4).C3(C) D(5).C1(C) D(5).C2(C) D(5).C3(C) D(6).C1(C) D(6).C2(C) D(6).C3(C) D(7).C1(C) D(7).C2(C) D(7).C3(C) D(8).C1(C) D(8).C2(C) D(8).C3(C) D(9).C1(C) D(9).C2(C) D(9).C3(C) D(+).C1(C) D(+).C2(C) D(+).C3(C) D(-).C1(C) D(-).C2(C) D(-).C3(C) D(\\).C1(C) D(\\).C2(C) D(\\).C3(C) D(ESC).C1(C) D(ESC).C2(C) D(ESC).C3(C) D(~).C1(C) D(~).C2(C) D(~).C3(C) U$1.38(PF5(ADC5))
ROW2: D([).C1(C) D([).C2(C) D([).C3(C) D(]).C1(C) D(]).C2(C) D(]).C3(C) D(DEL).C1(C) D(DEL).C2(C) D(DEL).C3(C) D(E).C1(C) D(E).C2(C) D(E).C3(C) D(I).C1(C) D(I).C2(C) D(I).C3(C) D(O).C1(C) D(O).C2(C) D(O).C3(C) D(P).C1(C) D(P).C2(C) D(P).C3(C) D(Q).C1(C) D(Q).C2(C) D(Q).C3(C) D(R).C1(C) D(R).C2(C) D(R).C3(C) D(T).C1(C) D(T).C2(C) D(T).C3(C) D(TAB).C1(C) D(TAB).C2(C) D(TAB).C3(C) D(U).C1(C) D(U).C2(C) D(U).C3(C) D(W).C1(C) D(W).C2(C) D(W).C3(C) D(Y).C1(C) D(Y).C2(C) D(Y).C3(C) U$1.37(PF6(ADC6))
ROW3: D(A).C1(C) D(A).C2(C) D(A).C3(C) D(CAPS).C1(C) D(CAPS).C2(C) D(CAPS).C3(C) D(COLON).C1(C) D(COLON).C2(C) D(COLON).C3(C) D(D).C1(C) D(D).C2(C) D(D).C3(C) D(ENTER).C1(C) D(ENTER).C2(C) D(ENTER).C3(C) D(F).C1(C) D(F).C2(C) D(F).C3(C) D(G).C1(C) D(G).C2(C) D(G).C3(C) D(H).C1(C) D(H).C2(C) D(H).C3(C) D(J).C1(C) D(J).C2(C) D(J).C3(C) D(K).C1(C) D(K).C2(C) D(K).C3(C) D(L).C1(C) D(L).C2(C) D(L).C3(C) D(QUOTE).C1(C) D(QUOTE).C2(C) D(QUOTE).C3(C) D(S).C1(C) D(S).C2(C) D(S).C3(C) U$1.36(PF7(ADC7))
ROW4: D(<).C1(C) D(<).C2(C) D(<).C3(C) D(>).C1(C) D(>).C2(C) D(>).C3(C) D(?).C1(C) D(?).C2(C) D(?).C3(C) D(B).C1(C) D(B).C2(C) D(B).C3(C) D(C).C1(C) D(C).C2(C) D(C).C3(C) D(FN).C1(C) D(FN).C2(C) D(FN).C3(C) D(LSHIFT).C1(C) D(LSHIFT).C2(C) D(LSHIFT).C3(C) D(M).C1(C) D(M).C2(C) D(M).C3(C) D(N).C1(C) D(N).C2(C) D(N).C3(C) D(RSHIFT).C1(C) D(RSHIFT).C2(C) D(RSHIFT).C3(C) D(V).C1(C) D(V).C2(C) D(V).C3(C) D(X).C1(C) D(X).C2(C) D(X).C3(C) D(Z).C1(C) D(Z).C2(C) D(Z).C3(C) U$1.40(PF1(ADC1))
ROW6: D(LALT).C1(C) D(LALT).C2(C) D(LALT).C3(C) D(LCTRL).C1(C) D(LCTRL).C2(C) D(LCTRL).C3(C) D(LSUPER).C1(C) D(LSUPER).C2(C) D(LSUPER).C3(C) D(RALT).C1(C) D(RALT).C2(C) D(RALT).C3(C) D(RCTRL).C1(C) D(RCTRL).C2(C) D(RCTRL).C3(C) D(RSUPER).C1(C) D(RSUPER).C2(C) D(RSUPER).C3(C) D(SPC).C1(C) D(SPC).C2(C) D(SPC).C3(C) U$1.25(PD4(ADC8))
VCC: C4.1 C5.1 C6.1 C7.1 C8.1 L(LSUPER).B1 L(LSUPER).B2 L(LSUPER).B3 R3.1 R(0).A1 R(0).A2 R(0).A3 R(1).A1 R(1).A2 R(1).A3 R(2).A1 R(2).A2 R(2).A3 R(3).A1 R(3).A2 R(3).A3 R(4).A1 R(4).A2 R(4).A3 R(5).A1 R(5).A2 R(5).A3 R(6).A1 R(6).A2 R(6).A3 R(7).A1 R(7).A2 R(7).A3 R(8).A1 R(8).A2 R(8).A3 R(9).A1 R(9).A2 R(9).A3 R(+).A1 R(+).A2 R(+).A3 R(-).A1 R(-).A2 R(-).A3 R(<).A1 R(<).A2 R(<).A3 R(>).A1 R(>).A2 R(>).A3 R(?).A1 R(?).A2 R(?).A3 R([).A1 R([).A2 R([).A3 R(\\).A1 R(\\).A2 R(\\).A3 R(]).A1 R(]).A2 R(]).A3 R(A).A1 R(A).A2 R(A).A3 R(B).A1 R(B).A2 R(B).A3 R(C).A1 R(C).A2 R(C).A3 R(CAPS).A1 R(CAPS).A2 R(CAPS).A3 R(COLON).A1 R(COLON).A2 R(COLON).A3 R(D).A1 R(D).A2 R(D).A3 R(DEL).A1 R(DEL).A2 R(DEL).A3 R(E).A1 R(E).A2 R(E).A3 R(ENTER).A1 R(ENTER).A2 R(ENTER).A3 R(ESC).A1 R(ESC).A2 R(ESC).A3 R(F).A1 R(F).A2 R(F).A3 R(FN).A1 R(FN).A2 R(FN).A3 R(G).A1 R(G).A2 R(G).A3 R(H).A1 R(H).A2 R(H).A3 R(I).A1 R(I).A2 R(I).A3 R(J).A1 R(J).A2 R(J).A3 R(K).A1 R(K).A2 R(K).A3 R(L).A1 R(L).A2 R(L).A3 R(LALT).B1 R(LALT).B2 R(LALT).B3 R(LCTRL).B1 R(LCTRL).B2 R(LCTRL).B3 R(LSHIFT).A1 R(LSHIFT).A2 R(LSHIFT).A3 R(M).A1 R(M).A2 R(M).A3 R(N).A1 R(N).A2 R(N).A3 R(O).A1 R(O).A2 R(O).A3 R(P).A1 R(P).A2 R(P).A3 R(Q).A1 R(Q).A2 R(Q).A3 R(QUOTE).A1 R(QUOTE).A2 R(QUOTE).A3 R(R).A1 R(R).A2 R(R).A3 R(RALT).A1 R(RALT).A2 R(RALT).A3 R(RCTRL).A1 R(RCTRL).A2 R(RCTRL).A3 R(RSHIFT).A1 R(RSHIFT).A2 R(RSHIFT).A3 R(RSUPER).A1 R(RSUPER).A2 R(RSUPER).A3 R(S).A1 R(S).A2 R(S).A3 R(SPC).A1 R(SPC).A2 R(SPC).A3 R(T).A1 R(T).A2 R(T).A3 R(TAB).A1 R(TAB).A2 R(TAB).A3 R(U).A1 R(U).A2 R(U).A3 R(V).A1 R(V).A2 R(V).A3 R(W).A1 R(W).A2 R(W).A3 R(X).A1 R(X).A2 R(X).A3 R(Y).A1 R(Y).A2 R(Y).A3 R(Z).A1 R(Z).A2 R(Z).A3 R(~).A1 R(~).A2 R(~).A3 U$1.2(UVCC) U$1.7(VBUS) U$1.14(VCC) U$1.24(AVCC) U$1.34(VCC) U$1.44(AVCC) X1.1
Unconnected: K(SPC).LED- U$2.1(P) U$3.P$1 U$4.P$1 U$5.P$1 U$6.P$1

## Library data of the parts
C1-C8 = rcl:C-EU: CAPACITOR, European symbol; SPICEPREFIX: C
D(0) D(1) D(2) D(3) D(4) D(5) D(6) D(7) D(8) D(9) D(+) D(-) D(<) D(>) D(?) D([) D(\\) D(]) D(A) D(B) D(C) D(CAPS) D(COLON) D(D) D(DEL) D(E) D(ENTER) D(ESC) D(F) D(FN) D(G) D(H) D(I) D(J) D(K) D(L) D(LALT) D(LCTRL) D(LSHIFT) D(LSUPER) D(M) D(N) D(O) D(P) D(Q) D(QUOTE) D(R) D(RALT) D(RCTRL) D(RSHIFT) D(RSUPER) D(S) D(SPC) D(T) D(TAB) D(U) D(V) D(W) D(X) D(Y) D(Z) D(~) = Components:DIODE: Standard 1N4148 diode
K(0) K(1) K(2) K(3) K(4) K(5) K(6) K(7) K(8) K(9) K(+) K(-) K(<) K(>) K(?) K([) K(\\) K(]) K(A) K(B) K(C) K(CAPS) K(COLON) K(D) K(DEL) K(E) K(ENTER) K(ESC) K(F) K(FN) K(G) K(H) K(I) K(J) K(K) K(L) K(LALT) K(LCTRL) K(LSHIFT) K(LSUPER) K(M) K(N) K(P) K(Q) K(QUOTE) K(R) K(RALT) K(RCTRL) K(RSHIFT) K(RSUPER) K(S) K(SPC) K(T) K(TAB) K(U) K(V) K(W) K(X) K(Y) K(Z) K(~) = Keyboard:KEYSWITCH-LEDTHTHOLE
K(O) = Keyboard:KEYSWITCH-SMDLED
L(LSUPER) R(0) R(1) R(2) R(3) R(4) R(5) R(6) R(7) R(8) R(9) R(+) R(-) R(<) R(>) R(?) R([) R(\\) R(]) R(A) R(B) R(C) R(CAPS) R(COLON) R(D) R(DEL) R(E) R(ENTER) R(ESC) R(F) R(FN) R(G) R(H) R(I) R(J) R(K) R(L) R(LALT) R(LCTRL) R(LSHIFT) R(M) R(N) R(O) R(P) R(Q) R(QUOTE) R(R) R(RALT) R(RCTRL) R(RSHIFT) R(RSUPER) R(S) R(SPC) R(T) R(TAB) R(U) R(V) R(W) R(X) R(Y) R(Z) R(~) = Components:RESISTOR
Q1 = crystal-geyer_V1_0:KX: Quartz Crystals (MHz) SMD: KX - Serie Model Size l/w/h [mm] Frequency Range Frequency Stability Temp. Range [°C] Load Capacitance AECQ 200 availabel Datasheet KX-4 KX-5 KX-6 KX-7 KX-9A KX-9B KX-12A KX-12B KX-13 KX-20 KX-K KX-KS 1.6/1.2/0.3 2.0/1.6/0.45 2.5/2.0/0.55 3.2/2.5/0.8 5.0/3.2/1.0 5.0/3.2/1.1 6.0/3.5/1.1 6.0/3.5/1.0 7.0/5.0 /1.3 11.6/5.5/1.6 12.3/4.5/4.2 12.3/4.5/3.2 24.0 ~ 80.0 MHz 16.0 ~ 80.0 MHz 12.0 ~ 80.0 MHz 8.0 ~ 60.0 MHz 7,68 ~ 300,0 MHz 8,0 ~ 50,0 MHz 8,0 ~ 150,0 MHz 8,0 ~ 50,0 MHz 6,0 ~ 160,0 MHz 3,579 ~ 25,0 MHz 3,579 ~ 70,0 MHz 3,579 ~ 70,0 MHz ±10 … ±50ppm ±10 … ±50ppm ±10 … ±50ppm ±10 … ±50ppm ±10 … ±50ppm ±10 … ±50ppm ±10 … ±50ppm ±10 … ±50ppm ±10 … ±50ppm ±50ppm ±10 … ±50ppm ±10 … ±50ppm (*) -40°C …+85°C (*) -40°C …+125°C (*) -40°C …+125°C (*) -40°C …+125°C (*) -40°C …+105°C (*) -40°C …+105°C (*) -40°C …+125°C (*) -40°C …+105°C (*) -40°C …+105°C (*) -40°C …+105°C (*) -40°C …+85°C (*) -40°C …+85°C 8, 8…16 8, 8…16 10, 8…16 12, 7…20 16, 10…20 16, 10…20 16, 10…20 16, 12…20 16, 12…20 16, 12…20 16, 12…30 16, 12…30 - yes yes yes - - - - - - - - KX-4.pdf <http://www.geyer-electronic.de/uploads/tx_userartikelfrequenz/GEYER-KX-4.pdf> KX-5.pdf <http://www.geyer-electronic.de/uploads/tx_userartikelfrequenz/GEYER-KX-5.pdf> KX-6.pdf <http://www.geyer-electronic.de/uploads/tx_userartikelfrequenz/GEYER-KX-6.pdf> KX-7.pdf <http://www.geyer-electronic.de/uploads/tx_userartikelfrequenz/GEYER-KX-7.pdf> KX-9A.pdf <http://www.geyer-electronic.de/uploads/tx_userartikelfrequenz/GEYER-KX-9A.pdf> KX-9B.pdf <http://www.geyer-electronic.de/uploads/tx_userartikelfrequenz/GEYER-KX-9B.pdf> KX-12A.pdf <http://www.geyer-electronic.de/uploads/tx_userartikelfrequenz/GEYER-KX-12A.pdf> KX-12B.pdf <http://www.geyer-electronic.de/uploads/tx_userartikelfrequenz/GEYER-KX-12B.pdf> KX-13.pdf <http://www.geyer-electronic.de/uploads/tx_userartikelfrequenz/GEYER-KX-13.pdf> KX-20.pdf <http://www.geyer-electronic.de/uploads/tx_userartikelfrequenz/GEYER-KX-20.pdf> KX-K.pdf <http://www.geyer-electronic.de/uploads/tx_userartikelfrequenz/GEYER-KX-K.pdf> KX-KS.pdf <http://www.geyer-electronic.de/uploads/tx_userartikelfrequenz/GEYER-KX-KS.pdf> <http://www.geyer-electronic.de/fileadmin/template/img/logo-geyer-electronic.png> Details see: http://www.geyer-electronic.de/Frequenz-Produkte.9.0.html Created 2016-06-07, Hans Locher 2016 (C) Geyer Quartz Technology KX4,KX5,KX6,KX7,KX9A,KX9B,KX12A,KX12B,KX13,KX20,KXK,KXKS;1612;2016;2520;3225;5032;6035;7050;11655;12345;1,6x1,2;2,0x1,6;2,5x2,0;3,2x2,5;5,0x3,2;6,0x3,5;7,0x5,0;11,6x5,5;12,3x4,5;12,3x4,5;1.6x1.2;2.0x1.6;2.5x2.0;3.2x2.5;5.0x3.2;6.0x3.5;7.0x5.0;11.6x5.5;12.3x4.5;12.3x4.5;
R1-R4 = eagle-ltspice:R: RESISTOR, European symbol; SPICEMODEL: NONE; SPICEPREFIX: R
S1 = switch-omron:10-XX: OMRON SWITCH; MPN: B3F-1000; OC_FARNELL: 176432; OC_NEWARK: 36M3542
U$1 = SparkFun-IC-Microcontroller:ATMEGA32U4: Atmel MCU, 32KByte Atmel 44-pin 8-bit Microcontroller with 32KBytes of ISP Flash and USB Controller Datasheet <http://cdn.sparkfun.com/datasheets/Dev/Arduino/Boards/ATMega32U4.pdf> SparkFun Products LilyPad Arduino USB - ATmega32U4 Board <https://www.sparkfun.com/products/12049> (DEV-12049) Pro Micro - 5V/16MHz <https://www.sparkfun.com/products/12640> (DEV-12640) Pro Micro - 3.3V/8MHz <https://www.sparkfun.com/products/12587> (DEV-12587) Fio v3 - ATmega32U4 <https://www.sparkfun.com/products/11520> (DEV-11520) Qduino Mini <https://www.sparkfun.com/products/13614> (DEV-13614) Makey Makey - Standard Kit <https://www.sparkfun.com/products/11511> (WIG-11511) Makey Makey Deluxe Kit <https://www.sparkfun.com/products/11519> (WIG-11519); PROD_ID: IC-11161
U$2 = wirepad:2,54/1,0: THROUGH-HOLE PAD
U$3-U$6 = Hardware:STANDOFF: Keystone Electrics Swage Threaded Standoff 6-32: 1612-2 1612-3 1612-4
X1 = con-hirose:MINI-USB-: MINI USB Connector Source: http://www.hirose.co.jp/cataloge_hp/e24000019.pdf; OC_FARNELL: unknown; OC_NEWARK: unknown

## Net classes
0 default: width 0.254 mm, clearance 0.254 mm